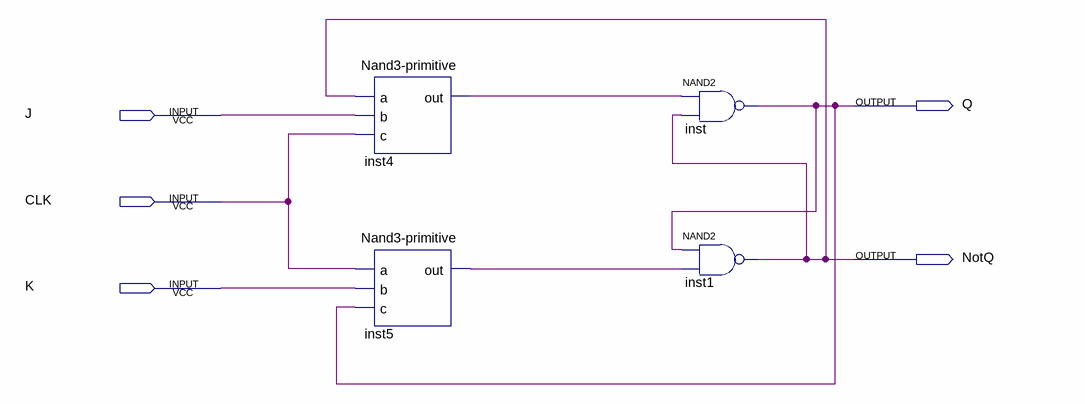
[diagram p0: schematic sheet]
// Quartus schematic JKFlipFlop.bdf as structural Verilog: 4 symbols, 5 pins
module JKFlipFlop (
  input  J,
  input  CLK,
  input  K,
  output Q,
  output NotQ
);

  wire inst4_out, inst5_out;

  \Nand3-primitive  inst4 (.a(NotQ), .b(J), .c(CLK), .out(inst4_out));
  \Nand3-primitive  inst5 (.a(CLK), .b(K), .c(Q), .out(inst5_out));
  nand inst (Q, inst4_out, NotQ);
  nand inst1 (NotQ, Q, inst5_out);
endmodule
